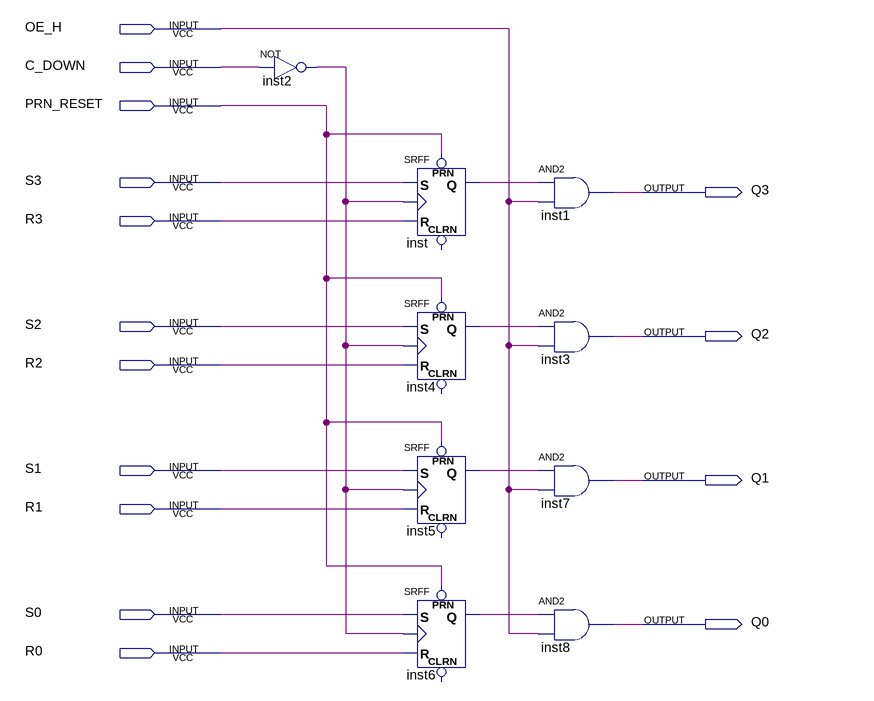
[diagram p0: schematic sheet]
// Quartus schematic Lab5_1.bdf as structural Verilog: 9 symbols, 15 pins
module Lab5_1 (
  input  OE_H,
  input  C_DOWN,
  input  PRN_RESET,
  input  S3,
  input  R3,
  input  S2,
  input  R2,
  input  S1,
  input  R1,
  input  S0,
  input  R0,
  output Q3,
  output Q2,
  output Q1,
  output Q0
);

  wire inst2_out, inst4_q, inst5_q, inst6_q, inst_q;

  not inst2 (inst2_out, C_DOWN);
  SRFF inst (.PRN(PRN_RESET), .S(S3), .R(R3), .CLK(inst2_out), .Q(inst_q));  // open: CLRN
  SRFF inst4 (.PRN(PRN_RESET), .S(S2), .R(R2), .CLK(inst2_out), .Q(inst4_q));  // open: CLRN
  SRFF inst5 (.PRN(PRN_RESET), .S(S1), .R(R1), .CLK(inst2_out), .Q(inst5_q));  // open: CLRN
  SRFF inst6 (.PRN(PRN_RESET), .S(S0), .R(R0), .CLK(inst2_out), .Q(inst6_q));  // open: CLRN
  and inst1 (Q3, inst_q, OE_H);
  and inst3 (Q2, inst4_q, OE_H);
  and inst7 (Q1, inst5_q, OE_H);
  and inst8 (Q0, inst6_q, OE_H);
endmodule
